# Altium schematic sheet Gas_Sampler-BME_280.SchDoc: BME 280
size Tabloid; Organization: Sensible Robotics LLC; Address1: 120 E Church Ave Suite B; Address2: Ridgecrest CA, 93555; Revision: 0; SheetNumber: 7; SheetTotal: 12; ApprovedBy: Approved Name; Engineer: Mike Licitra; PageSetup: Record=PageOptions|CenterHorizontal=True|CenterVertical=True|PrintScale=0.98|XCorrection=1.00|YCorrection=1.00|PrintKind=0|BorderSize=5000000|LeftOffset=0|BottomOffset=0|Orientation=2|PaperLength=1000|PaperWidth=1000|Scale=100|PaperSource=15|PrintQuality=600|MediaType=1|DitherType=10|PaperKind=Tabloid|PrintScaleMode=1
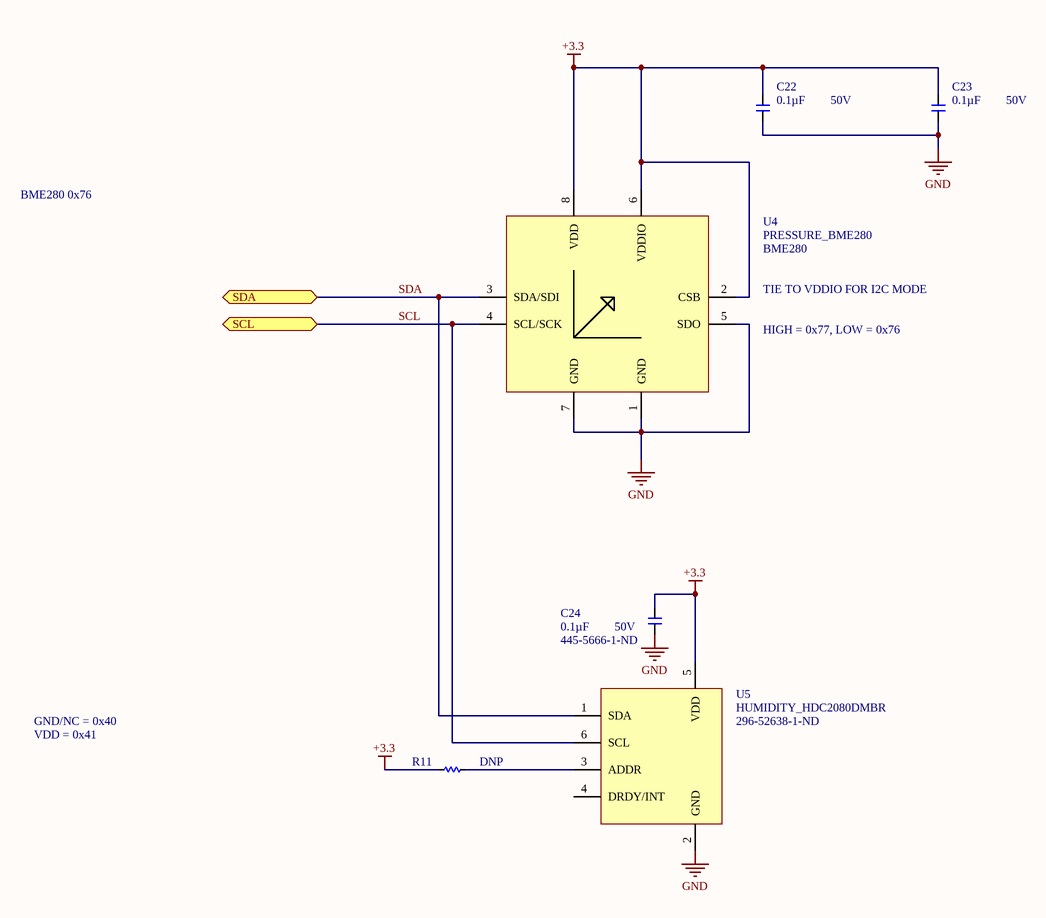
[diagram p0: Gas_Sampler-BME_280.SchDoc]

## Parts
C22  value 0.1µF  Voltage - Rated: 50V  [C0603]  (hidden comment: CAP_CER_0603_0.1UF_50V_10%_X7R)
C23  value 0.1µF  Voltage - Rated: 50V  [C0603]  (hidden comment: CAP_CER_0603_0.1UF_50V_10%_X7R)
C24  value 0.1µF  Voltage - Rated: 50V  Supplier Part Number 1: 445-5666-1-ND  [C0603]  (hidden comment: CAP_CER_0603_0.1UF_50V_10%_X7R)
R11  value DNP  [R0603]  (hidden comment: RES_0603_DNP)  (no BOM)
U4  PRESSURE_BME280  Manufacturer Part Number: BME280  [BOSCH_BME280]
U5  HUMIDITY_HDC2080DMBR  Supplier Part Number 1: 296-52638-1-ND  [6DFN3X3_NO_EP]

## Ports
SCL, SDA

## Nets
+3.3: C22.1 C23.1 C24.1 R11.1 U4.2(CSB) U4.6(VDDIO) U4.8(VDD) U5.5(VDD)
GND: C22.2 C23.2 C24.2 U4.1(GND) U4.5(SDO) U4.7(GND) U5.2(GND)
SCL: U4.4(SCL/SCK) U5.6(SCL) ; port SCL
SDA: U4.3(SDA/SDI) U5.1(SDA) ; port SDA
NetR11_2: R11.2 U5.3(ADDR)

Not connected (* = marked no-connect by the designer): U5 4(DRDY/INT)

## Notes on the sheet
- BME280 0x76
- TIE TO VDDIO FOR I2C MODE
- HIGH = 0x77, LOW = 0x76
- GND/NC = 0x40
- VDD = 0x41
- CONFIDENTIAL DOCUMENT
- DUPLICATION PROHIBITED
- ENGINEER
- PCB FAB #
- SCH #
- REV
- Sensible
- Robotics
- THIS DOCUMENT CONTAINS INFORMATION AND OR DATA, WHICH IS PROPRIETARY AND CONFIDENTIAL TO SENSIBLE ROBOTICS LLC.  THIS INFORMATION AND OR DATA, IS TO BE USED ONLY FOR THE BENEFIT OF THE SUPPLIER, AND IS NOT TO BE USED FOR THE BENEFIT OF OTHER PARTIES WITHOUT WRITTEN CONSENT.
- DATE
- PCB ASSY #
- SIZE
- Tabloid
- SHEET
- OF
- FILE

## Library data of the parts
C22-C24 = CAP_CER_0603_0.1UF_50V_10%_X7R: CAP CER 0.1UF 50V 10% X7R 0603; Manufacturer: TDK Corporation; Manufacturer Part Number: CGA3E2X7R1H104K080AA; Supplier 1: Digi-Key; RoHS: RoHS Compliant; Category: Capacitors; Stock 1: 320000; Pricing 1: 1=0.1, 10=0.072, 100=0.033, 250=0.027, 500=0.0231, 1000=0.018 (USD); Packaging: Cut Tape (CT); Tolerance: ±10%; Temperature Coefficient: X7R; Mounting Type: Surface Mount, MLCC; Operating Temperature: -55°C ~ 125°C; Applications: Automotive; Ratings: AEC-Q200; Package / Case: 0603 (1608 Metric); Size / Dimension: 0.063" L x 0.031" W (1.60mm x 0.80mm); Height - Seated (Max): -; Thickness (Max): 0.035" (0.90mm); Lead Spacing: -; Features: -; Lead Style: -; ComponentLink1URL: http://product.tdk.com/capacitor/mlcc/en/documents/mlcc_automotive_general_en.pdf; ComponentLink1Description: http://product.tdk.com/capacitor/mlcc/en/documents/mlcc_automotive_general_en.pdf
  C22 C23: Supplier Part Number 1: 445-5666-1-ND
R11 = RES_0603_DNP: RES DNP 0603 SMD; Part Number: 000-00000-00; Supplier 1: Digi-Key; Supplier Part Number 1: DNP
U4 = PRESSURE_BME280: SENSOR PRESSURE HUMIDITY TEMP; Manufacturer: Bosch Sensortec; Sensor Type: Humidity, Pressure, Temperature; Humidity Range: 0 ~ 100% RH; Output Type: I²C, SPI; Output: 16b; Accuracy: ±3%; Voltage - Supply: 1.71 V ~ 3.6 V; Supplier 1: Digi-Key; RoHS: RoHS Compliant; Category: Sensors, Transducers; Stock 1: 45909; Pricing 1: 1=7.56, 5=6.628, 10=5.965, 25=5.302, 50=4.9044, 100=4.2416, 500=3.9765, 1000=3.7114 (USD); Packaging: Cut Tape (CT); Part Status: Active; Mounting Type: Surface Mount; Operating Temperature: -40°C ~ 85°C; Package / Case: 8-VFLGA; Supplier Device Package: 8-LGA (2.5x2.5); ComponentLink1URL: https://ae-bst.resource.bosch.com/media/_tech/media/datasheets/BST-BME280_DS001-12.pdf; ComponentLink1Description: https://ae-bst.resource.bosch.com/media/_tech/media/datasheets/BST-BME280_DS001-12.pdf; Supplier Part Number 1: 828-1063-1-ND
U5 = HUMIDITY_HDC2080DMBR: Humidity Temperature Sensor 0 ~ 100% RH I²C ±2% RH Surface Mount; Manufacturer: Texas Instruments; Accuracy: ±2% RH; Voltage - Supply: 1.62V ~ 3.6V; Response Time: 8s; Supplier 1: Digi-Key; Manufacturer Part Number: HDC2080DMBR; Packaging: Cut Tape (CT); Operating Temperature: -40°C ~ 85°C; Package / Case: 6-WDFN Exposed Pad; Supplier Device Package: 6-WSON (3x3); ComponentLink1URL: http://www.ti.com/general/docs/suppproductinfo.tsp?distId=10&gotoUrl=http%3A%2F%2Fwww.ti.com%2Flit%2Fgpn%2Fhdc2080; ComponentLink1Description: http://www.ti.com/general/docs/suppproductinfo.tsp?distId=10&gotoUrl=http%3A%2F%2Fwww.ti.com%2Flit%2Fgpn%2Fhdc2080; Humidity Range: 0 ~ 100% RH